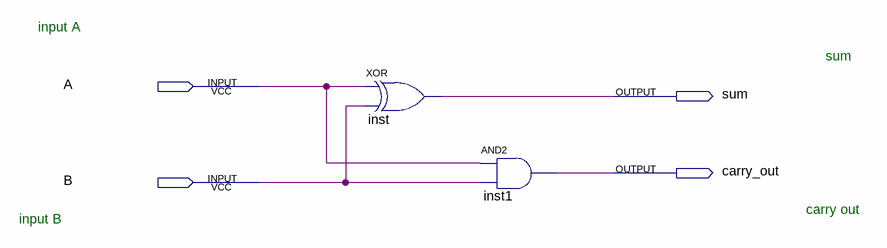
[diagram p0: schematic sheet]
// Quartus schematic halfadder.bdf as structural Verilog: 2 symbols, 4 pins
module halfadder (
  input  A,
  input  B,
  output sum,
  output carry_out
);

  xor inst (sum, A, B);
  and inst1 (carry_out, A, B);

  // Notes on the sheet:
  //   input A
  //   sum
  //   carry out
  //   input B
endmodule
